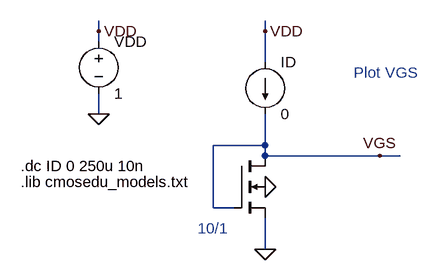
[diagram p0: schematic Fig26_1_nmos.asc]
Fig26_1_nmos.asc, the LTspice schematic file:
Version 4
SHEET 1 1136 680
WIRE 192 -368 192 -384
WIRE 192 -352 192 -368
WIRE 192 -240 192 -272
WIRE 368 -96 368 -192
WIRE 400 -96 368 -96
WIRE 448 -368 448 -384
WIRE 448 -320 448 -368
WIRE 448 -192 368 -192
WIRE 448 -192 448 -240
WIRE 448 -176 448 -192
WIRE 448 -32 448 -80
WIRE 624 -176 448 -176
WIRE 656 -176 624 -176
FLAG 624 -176 VGS
FLAG 448 -128 0
FLAG 192 -240 0
FLAG 192 -368 VDD
FLAG 448 -32 0
FLAG 448 -368 VDD
SYMBOL nmos4 400 -176 R0
WINDOW 0 104 24 Invisible 0
WINDOW 3 179 41 Invisible 0
SYMATTR InstName M1
SYMATTR Value N_50n
SYMATTR Value2 l=50n w=500n
SYMBOL voltage 192 -368 R0
WINDOW 123 0 0 Left 0
WINDOW 39 0 0 Left 0
SYMATTR InstName VDD
SYMATTR Value 1
SYMBOL current 448 -320 R0
SYMATTR InstName ID
SYMATTR Value 0
TEXT 72 -160 Left 0 !.dc ID 0 250u 10n
TEXT 72 -136 Left 0 !.lib cmosedu_models.txt
TEXT 344 -64 Left 0 ;10/1
TEXT 584 -304 Left 0 ;Plot VGS

The netlist it stands for:
* Fig26_1_nmos.asc
M1 VGS VGS 0 0 N_50n l=50n w=500n
VDD VDD 0 1
ID VDD VGS 0
.model NMOS NMOS
.model PMOS PMOS
.lib standard.mos
.dc ID 0 250u 10n
.lib cmosedu_models.txt
* 10/1
* Plot VGS
.backanno
.end